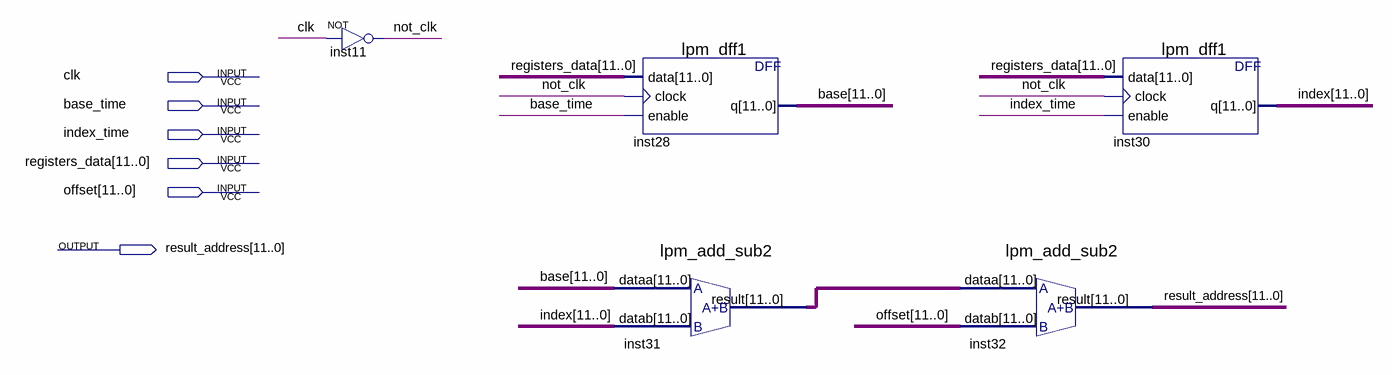
[diagram p0: schematic sheet]
// Quartus schematic address_resolver.bdf as structural Verilog: 5 symbols, 6 pins
module address_resolver (
  input  clk,
  input  base_time,
  input  index_time,
  input  [11:0] registers_data,
  input  [11:0] offset,
  output [11:0] result_address
);

  wire not_clk;
  wire [11:0] base, index, inst31_result;

  not inst11 (not_clk, clk);
  lpm_dff1 inst28 (.data(registers_data), .clock(not_clk), .enable(base_time), .q(base));
  lpm_add_sub2 inst31 (.dataa(base), .datab(index), .result(inst31_result));
  lpm_add_sub2 inst32 (.dataa(inst31_result), .datab(offset), .result(result_address));
  lpm_dff1 inst30 (.data(registers_data), .clock(not_clk), .enable(index_time), .q(index));
endmodule
